# EAGLE schematic MainBoard (EAGLE 9.1.2)
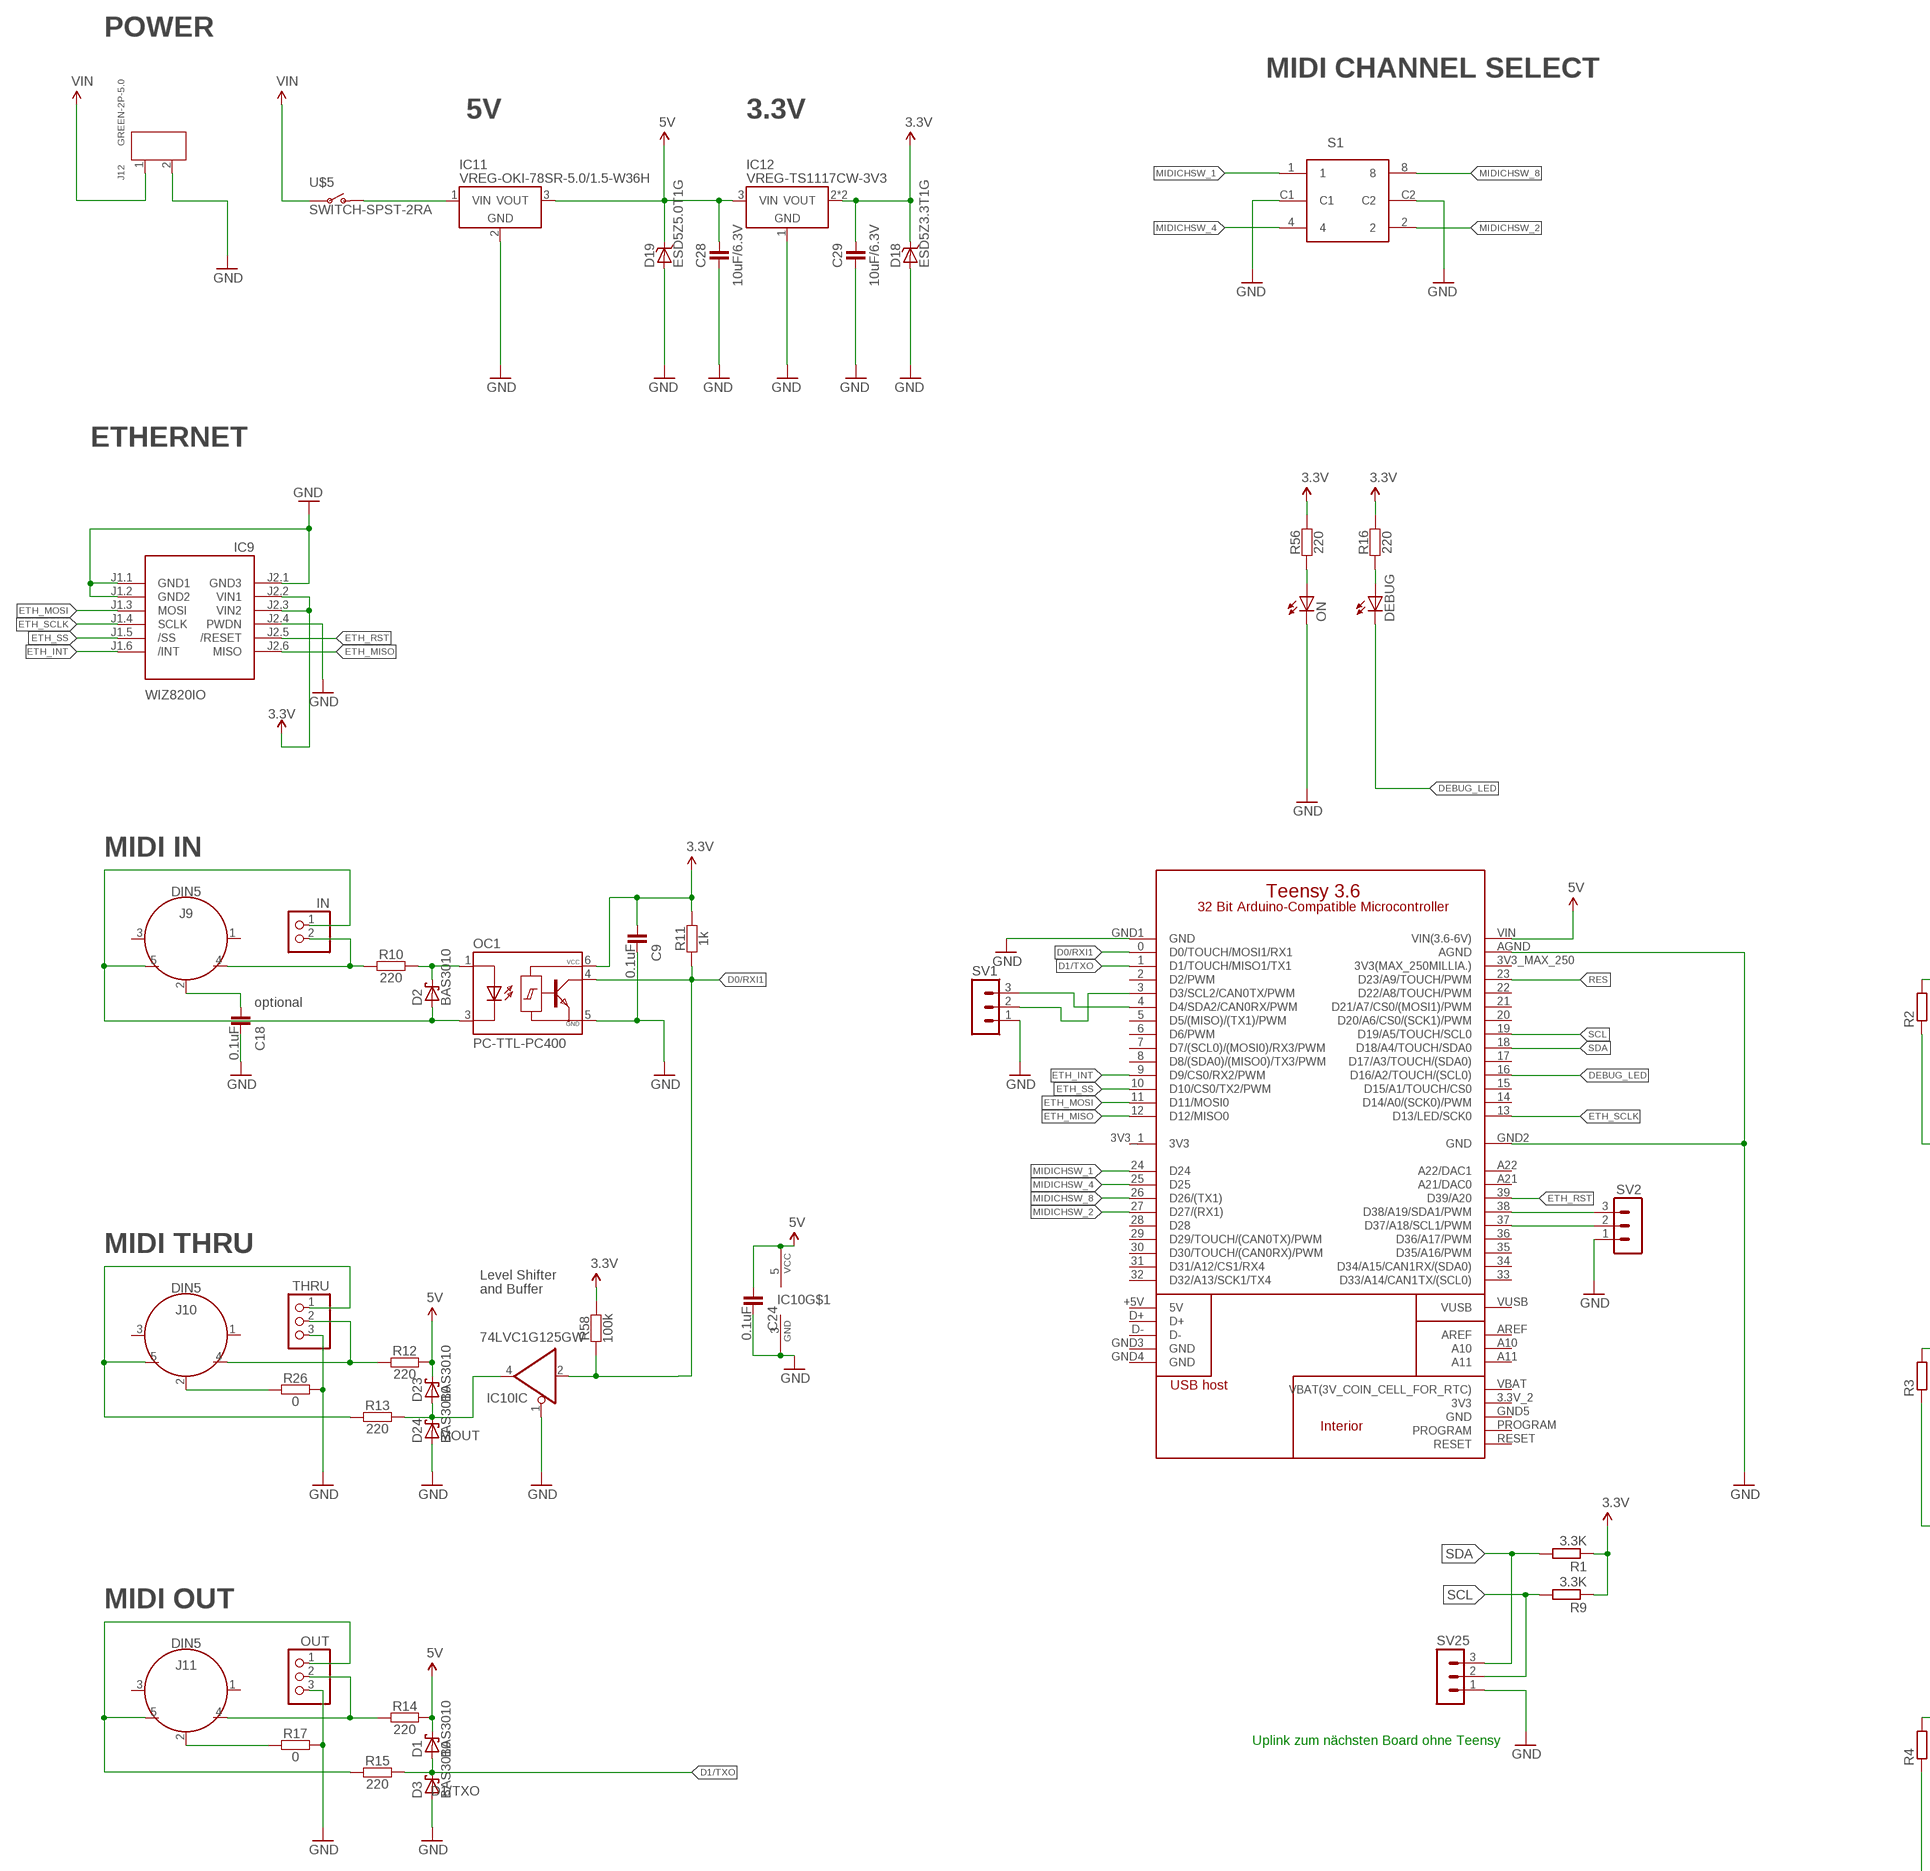
[diagram p0: schematic, sheet 1, part 1 of 2]
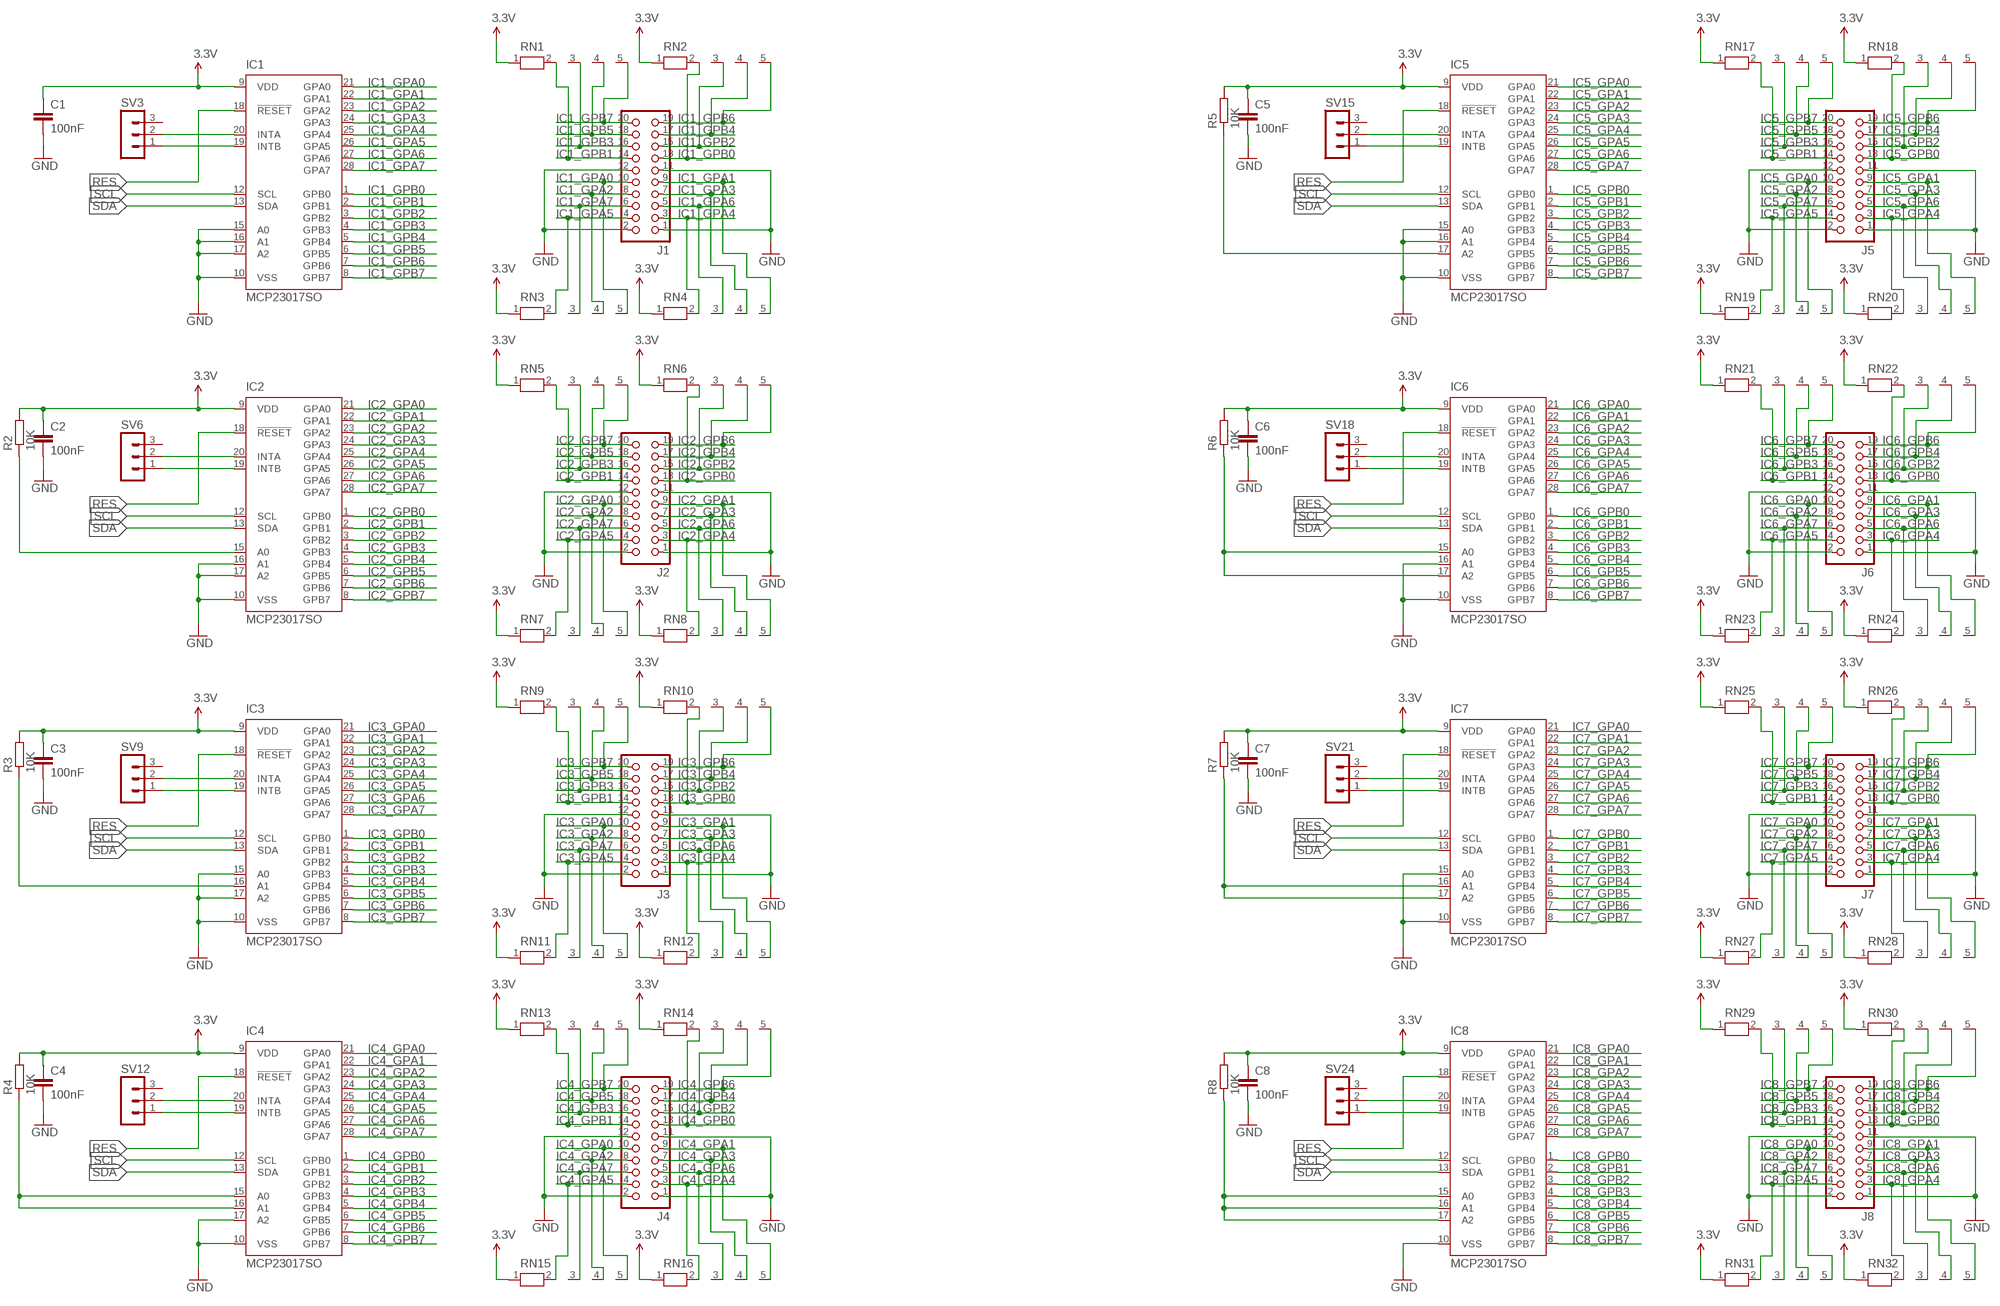
[diagram p1: schematic, sheet 1, part 2 of 2]

## Parts
C1  100nF  C-EUC0805  [C0805]
C2  100nF  C-EUC0805  [C0805]
C3  100nF  C-EUC0805  [C0805]
C4  100nF  C-EUC0805  [C0805]
C5  100nF  C-EUC0805  [C0805]
C6  100nF  C-EUC0805  [C0805]
C7  100nF  C-EUC0805  [C0805]
C8  100nF  C-EUC0805  [C0805]
C9  0.1uF  CAPACITOR-0805  [C0805]
C18  0.1uF  CAPACITOR-0805  [C0805]
C24  0.1uF  CAPACITOR-0805  [C0805]
C28  10uF/6.3V  CAPACITOR-0805  [C0805]
C29  10uF/6.3V  CAPACITOR-0805  [C0805]
D1  BAS3010  D_SCHOTTKY-SOD323  [SOD323]
D2  BAS3010  D_SCHOTTKY-SOD323  [SOD323]
D3  BAS3010  D_SCHOTTKY-SOD323  [SOD323]
D18  ESD5Z3.3T1G  D_TVS-SOD523  [SOD523]
D19  ESD5Z5.0T1G  D_TVS-SOD523  [SOD523]
D23  BAS3010  D_SCHOTTKY-SOD323  [SOD323]
D24  BAS3010  D_SCHOTTKY-SOD323  [SOD323]
DEBUG  Red  LED-3MM  [LED_3MM]
IC1  MCP23017SO  [SO28W]
IC2  MCP23017SO  [SO28W]
IC3  MCP23017SO  [SO28W]
IC4  MCP23017SO  [SO28W]
IC5  MCP23017SO  [SO28W]
IC6  MCP23017SO  [SO28W]
IC7  MCP23017SO  [SO28W]
IC8  MCP23017SO  [SO28W]
IC9  WIZ820IO_DEVICE'DUAL-IN-LINE'  [WIZ820IO]
IC10  74LVC1G125GW  74HCT1G125GW  [SOT353]
IC11  VREG-OKI-78SR-5.0/1.5-W36H  [OKI-78SR-H]
IC12  VREG-TS1117CW-3V3  [SOT223]
IN  PINHD-1X2  [1X02]
J1  CON_HEADER_2X10-SHROUDED  [PINSHRD_PTH_2X10]
J2  CON_HEADER_2X10-SHROUDED  [PINSHRD_PTH_2X10]
J3  CON_HEADER_2X10-SHROUDED  [PINSHRD_PTH_2X10]
J4  CON_HEADER_2X10-SHROUDED  [PINSHRD_PTH_2X10]
J5  CON_HEADER_2X10-SHROUDED  [PINSHRD_PTH_2X10]
J6  CON_HEADER_2X10-SHROUDED  [PINSHRD_PTH_2X10]
J7  CON_HEADER_2X10-SHROUDED  [PINSHRD_PTH_2X10]
J8  CON_HEADER_2X10-SHROUDED  [PINSHRD_PTH_2X10]
J9  DIN5  [DIN5-RA-PTH]
J10  DIN5  [DIN5-RA-PTH]
J11  DIN5  [DIN5-RA-PTH]
J12  GREEN-2P-5.0  SCREW-TERMINAL-GREEN(2P-5.0)  [H2-5.0-10.5X8.0MM]
OC1  PC-TTL-PC400  [MINIFLAT5]
ON  Red  LED-3MM  [LED_3MM]
OUT  PINHD-1X3  [1X03]
R1  3.3K  R-EU_R0805  [R0805]
R2  10K  R-EU_R0805  [R0805]
R3  10K  R-EU_R0805  [R0805]
R4  10K  R-EU_R0805  [R0805]
R5  10K  R-EU_R0805  [R0805]
R6  10K  R-EU_R0805  [R0805]
R7  10K  R-EU_R0805  [R0805]
R8  10K  R-EU_R0805  [R0805]
R9  3.3K  R-EU_R0805  [R0805]
R10  220  RESISTOR-0805  [C0805]
R11  1k  RESISTOR-0805  [C0805]
R12  220  RESISTOR-0805  [C0805]
R13  220  RESISTOR-0805  [C0805]
R14  220  RESISTOR-0805  [C0805]
R15  220  RESISTOR-0805  [C0805]
R16  220  RESISTOR-0805  [C0805]
R17  0  RESISTOR-0805  [C0805]
R26  0  RESISTOR-0805  [C0805]
R56  220  RESISTOR-0805  [C0805]
R58  100k  RESISTOR-0805  [C0805]
RN1  RN04  [RN-5]
RN2  RN04  [RN-5]
RN3  RN04  [RN-5]
RN4  RN04  [RN-5]
RN5  RN04  [RN-5]
RN6  RN04  [RN-5]
RN7  RN04  [RN-5]
RN8  RN04  [RN-5]
RN9  RN04  [RN-5]
RN10  RN04  [RN-5]
RN11  RN04  [RN-5]
RN12  RN04  [RN-5]
RN13  RN04  [RN-5]
RN14  RN04  [RN-5]
RN15  RN04  [RN-5]
RN16  RN04  [RN-5]
RN17  RN04  [RN-5]
RN18  RN04  [RN-5]
RN19  RN04  [RN-5]
RN20  RN04  [RN-5]
RN21  RN04  [RN-5]
RN22  RN04  [RN-5]
RN23  RN04  [RN-5]
RN24  RN04  [RN-5]
RN25  RN04  [RN-5]
RN26  RN04  [RN-5]
RN27  RN04  [RN-5]
RN28  RN04  [RN-5]
RN29  RN04  [RN-5]
RN30  RN04  [RN-5]
RN31  RN04  [RN-5]
RN32  RN04  [RN-5]
S1  428521420916  [428521420916]
SV1  MA03-1  [MA03-1]
SV2  MA03-1  [MA03-1]
SV3  MA03-1  [MA03-1]
SV6  MA03-1  [MA03-1]
SV9  MA03-1  [MA03-1]
SV12  MA03-1  [MA03-1]
SV15  MA03-1  [MA03-1]
SV18  MA03-1  [MA03-1]
SV21  MA03-1  [MA03-1]
SV24  MA03-1  [MA03-1]
SV25  MA03-1  [MA03-1]
THRU  PINHD-1X3  [1X03]
U$1  TEENSY-3.6_ONLY_HOLES  [TEENSY-3.6_ONLY_HOLES]
U$5  SWITCH-SPST-2RA  [R_SW_TH]

## Nets
3.3V: C1.1 C2.1 C3.1 C4.1 C5.1 C6.1 C7.1 C8.1 C9.2 C29.2 D18.C IC1.9(VDD) IC2.9(VDD) IC3.9(VDD) IC4.9(VDD) IC5.9(VDD) IC6.9(VDD) IC7.9(VDD) IC8.9(VDD) IC9.J2.2(VIN1) IC9.J2.3(VIN2) IC12.2(VOUT) IC12.4(VOUT) OC1.6(VCC) R1.1 R2.2 R3.2 R4.2 R5.2 R6.2 R7.2 R8.2 R9.1 R11.2 R16.2 R56.2 R58.2 RN1.1 RN2.1 RN3.1 RN4.1 RN5.1 RN6.1 RN7.1 RN8.1 RN9.1 RN10.1 RN11.1 RN12.1 RN13.1 RN14.1 RN15.1 RN16.1 RN17.1 RN18.1 RN19.1 RN20.1 RN21.1 RN22.1 RN23.1 RN24.1 RN25.1 RN26.1 RN27.1 RN28.1 RN29.1 RN30.1 RN31.1 RN32.1
5V: C24.2 C28.2 D1.C D19.C D23.C IC10.5(VCC) IC11.3(VOUT) IC12.3(VIN) R12.2 R14.2 U$1.VIN(VIN(3.6-6V))
D0/RXI1: IC10.2(IC:I) OC1.4(OUT) R11.1 R58.1 U$1.0(D0/TOUCH/MOSI1/RX1)
D1/TXO: D1.A D3.C R15.2 U$1.1(D1/TOUCH/MISO1/TX1)
DEBUG_LED: DEBUG.C U$1.16(D16/A2/TOUCH/(SCL0))
ETH_INT: IC9.J1.6(/INT) U$1.9(D9/CS0/RX2/PWM)
ETH_MISO: IC9.J2.6(MISO) U$1.12(D12/MISO0)
ETH_MOSI: IC9.J1.3(MOSI) U$1.11(D11/MOSI0)
ETH_RST: IC9.J2.5(/RESET) U$1.39(D39/A20)
ETH_SCLK: IC9.J1.4(SCLK) U$1.13(D13/LED/SCK0)
ETH_SS: IC9.J1.5(/SS) U$1.10(D10/CS0/TX2/PWM)
GND: C1.2 C2.2 C3.2 C4.2 C5.2 C6.2 C7.2 C8.2 C9.1 C18.1 C24.1 C28.1 C29.1 D3.A D18.A D19.A D24.A IC1.10(VSS) IC1.15(A0) IC1.16(A1) IC1.17(A2) IC2.10(VSS) IC2.16(A1) IC2.17(A2) IC3.10(VSS) IC3.15(A0) IC3.17(A2) IC4.10(VSS) IC4.17(A2) IC5.10(VSS) IC5.15(A0) IC5.16(A1) IC6.10(VSS) IC6.16(A1) IC7.10(VSS) IC7.15(A0) IC8.10(VSS) IC9.J1.1(GND1) IC9.J1.2(GND2) IC9.J2.1(GND3) IC9.J2.4(PWDN) IC10.1(IC:OE) IC10.3(GND) IC11.2(GND) IC12.1(GND) J1.1 J1.2 J1.11 J1.12 J2.1 J2.2 J2.11 J2.12 J3.1 J3.2 J3.11 J3.12 J4.1 J4.2 J4.11 J4.12 J5.1 J5.2 J5.11 J5.12 J6.1 J6.2 J6.11 J6.12 J7.1 J7.2 J7.11 J7.12 J8.1 J8.2 J8.11 J8.12 J12.2 OC1.5(GND) ON.C OUT.3 R17.2 R26.2 S1.C1 S1.C2 SV1.1 SV2.1 SV25.1 THRU.3 U$1.AGND U$1.GND1(GND) U$1.GND2(GND)
IC1_GPA0: IC1.21(GPA0) J1.10 RN3.5
IC1_GPA1: IC1.22(GPA1) J1.9 RN4.5
IC1_GPA2: IC1.23(GPA2) J1.8 RN3.4
IC1_GPA3: IC1.24(GPA3) J1.7 RN4.4
IC1_GPA4: IC1.25(GPA4) J1.3 RN4.2
IC1_GPA5: IC1.26(GPA5) J1.4 RN3.2
IC1_GPA6: IC1.27(GPA6) J1.5 RN4.3
IC1_GPA7: IC1.28(GPA7) J1.6 RN3.3
IC1_GPB0: IC1.1(GPB0) J1.13 RN2.2
IC1_GPB1: IC1.2(GPB1) J1.14 RN1.2
IC1_GPB2: IC1.3(GPB2) J1.15 RN2.3
IC1_GPB3: IC1.4(GPB3) J1.16 RN1.3
IC1_GPB4: IC1.5(GPB4) J1.17 RN2.4
IC1_GPB5: IC1.6(GPB5) J1.18 RN1.4
IC1_GPB6: IC1.7(GPB6) J1.19 RN2.5
IC1_GPB7: IC1.8(GPB7) J1.20 RN1.5
IC2_GPA0: IC2.21(GPA0) J2.10 RN7.5
IC2_GPA1: IC2.22(GPA1) J2.9 RN8.5
IC2_GPA2: IC2.23(GPA2) J2.8 RN7.4
IC2_GPA3: IC2.24(GPA3) J2.7 RN8.4
IC2_GPA4: IC2.25(GPA4) J2.3 RN8.2
IC2_GPA5: IC2.26(GPA5) J2.4 RN7.2
IC2_GPA6: IC2.27(GPA6) J2.5 RN8.3
IC2_GPA7: IC2.28(GPA7) J2.6 RN7.3
IC2_GPB0: IC2.1(GPB0) J2.13 RN6.2
IC2_GPB1: IC2.2(GPB1) J2.14 RN5.2
IC2_GPB2: IC2.3(GPB2) J2.15 RN6.3
IC2_GPB3: IC2.4(GPB3) J2.16 RN5.3
IC2_GPB4: IC2.5(GPB4) J2.17 RN6.4
IC2_GPB5: IC2.6(GPB5) J2.18 RN5.4
IC2_GPB6: IC2.7(GPB6) J2.19 RN6.5
IC2_GPB7: IC2.8(GPB7) J2.20 RN5.5
IC3_GPA0: IC3.21(GPA0) J3.10 RN11.5
IC3_GPA1: IC3.22(GPA1) J3.9 RN12.5
IC3_GPA2: IC3.23(GPA2) J3.8 RN11.4
IC3_GPA3: IC3.24(GPA3) J3.7 RN12.4
IC3_GPA4: IC3.25(GPA4) J3.3 RN12.2
IC3_GPA5: IC3.26(GPA5) J3.4 RN11.2
IC3_GPA6: IC3.27(GPA6) J3.5 RN12.3
IC3_GPA7: IC3.28(GPA7) J3.6 RN11.3
IC3_GPB0: IC3.1(GPB0) J3.13 RN10.2
IC3_GPB1: IC3.2(GPB1) J3.14 RN9.2
IC3_GPB2: IC3.3(GPB2) J3.15 RN10.3
IC3_GPB3: IC3.4(GPB3) J3.16 RN9.3
IC3_GPB4: IC3.5(GPB4) J3.17 RN10.4
IC3_GPB5: IC3.6(GPB5) J3.18 RN9.4
IC3_GPB6: IC3.7(GPB6) J3.19 RN10.5
IC3_GPB7: IC3.8(GPB7) J3.20 RN9.5
IC4_GPA0: IC4.21(GPA0) J4.10 RN15.5
IC4_GPA1: IC4.22(GPA1) J4.9 RN16.5
IC4_GPA2: IC4.23(GPA2) J4.8 RN15.4
IC4_GPA3: IC4.24(GPA3) J4.7 RN16.4
IC4_GPA4: IC4.25(GPA4) J4.3 RN16.2
IC4_GPA5: IC4.26(GPA5) J4.4 RN15.2
IC4_GPA6: IC4.27(GPA6) J4.5 RN16.3
IC4_GPA7: IC4.28(GPA7) J4.6 RN15.3
IC4_GPB0: IC4.1(GPB0) J4.13 RN14.2
IC4_GPB1: IC4.2(GPB1) J4.14 RN13.2
IC4_GPB2: IC4.3(GPB2) J4.15 RN14.3
IC4_GPB3: IC4.4(GPB3) J4.16 RN13.3
IC4_GPB4: IC4.5(GPB4) J4.17 RN14.4
IC4_GPB5: IC4.6(GPB5) J4.18 RN13.4
IC4_GPB6: IC4.7(GPB6) J4.19 RN14.5
IC4_GPB7: IC4.8(GPB7) J4.20 RN13.5
IC5_GPA0: IC5.21(GPA0) J5.10 RN19.5
IC5_GPA1: IC5.22(GPA1) J5.9 RN20.5
IC5_GPA2: IC5.23(GPA2) J5.8 RN19.4
IC5_GPA3: IC5.24(GPA3) J5.7 RN20.4
IC5_GPA4: IC5.25(GPA4) J5.3 RN20.2
IC5_GPA5: IC5.26(GPA5) J5.4 RN19.2
IC5_GPA6: IC5.27(GPA6) J5.5 RN20.3
IC5_GPA7: IC5.28(GPA7) J5.6 RN19.3
IC5_GPB0: IC5.1(GPB0) J5.13 RN18.2
IC5_GPB1: IC5.2(GPB1) J5.14 RN17.2
IC5_GPB2: IC5.3(GPB2) J5.15 RN18.3
IC5_GPB3: IC5.4(GPB3) J5.16 RN17.3
IC5_GPB4: IC5.5(GPB4) J5.17 RN18.4
IC5_GPB5: IC5.6(GPB5) J5.18 RN17.4
IC5_GPB6: IC5.7(GPB6) J5.19 RN18.5
IC5_GPB7: IC5.8(GPB7) J5.20 RN17.5
IC6_GPA0: IC6.21(GPA0) J6.10 RN23.5
IC6_GPA1: IC6.22(GPA1) J6.9 RN24.5
IC6_GPA2: IC6.23(GPA2) J6.8 RN23.4
IC6_GPA3: IC6.24(GPA3) J6.7 RN24.4
IC6_GPA4: IC6.25(GPA4) J6.3 RN24.2
IC6_GPA5: IC6.26(GPA5) J6.4 RN23.2
IC6_GPA6: IC6.27(GPA6) J6.5 RN24.3
IC6_GPA7: IC6.28(GPA7) J6.6 RN23.3
IC6_GPB0: IC6.1(GPB0) J6.13 RN22.2
IC6_GPB1: IC6.2(GPB1) J6.14 RN21.2
IC6_GPB2: IC6.3(GPB2) J6.15 RN22.3
IC6_GPB3: IC6.4(GPB3) J6.16 RN21.3
IC6_GPB4: IC6.5(GPB4) J6.17 RN22.4
IC6_GPB5: IC6.6(GPB5) J6.18 RN21.4
IC6_GPB6: IC6.7(GPB6) J6.19 RN22.5
IC6_GPB7: IC6.8(GPB7) J6.20 RN21.5
IC7_GPA0: IC7.21(GPA0) J7.10 RN27.5
IC7_GPA1: IC7.22(GPA1) J7.9 RN28.5
IC7_GPA2: IC7.23(GPA2) J7.8 RN27.4
IC7_GPA3: IC7.24(GPA3) J7.7 RN28.4
IC7_GPA4: IC7.25(GPA4) J7.3 RN28.2
IC7_GPA5: IC7.26(GPA5) J7.4 RN27.2
IC7_GPA6: IC7.27(GPA6) J7.5 RN28.3
IC7_GPA7: IC7.28(GPA7) J7.6 RN27.3
IC7_GPB0: IC7.1(GPB0) J7.13 RN26.2
IC7_GPB1: IC7.2(GPB1) J7.14 RN25.2
IC7_GPB2: IC7.3(GPB2) J7.15 RN26.3
IC7_GPB3: IC7.4(GPB3) J7.16 RN25.3
IC7_GPB4: IC7.5(GPB4) J7.17 RN26.4
IC7_GPB5: IC7.6(GPB5) J7.18 RN25.4
IC7_GPB6: IC7.7(GPB6) J7.19 RN26.5
IC7_GPB7: IC7.8(GPB7) J7.20 RN25.5
IC8_GPA0: IC8.21(GPA0) J8.10 RN31.5
IC8_GPA1: IC8.22(GPA1) J8.9 RN32.5
IC8_GPA2: IC8.23(GPA2) J8.8 RN31.4
IC8_GPA3: IC8.24(GPA3) J8.7 RN32.4
IC8_GPA4: IC8.25(GPA4) J8.3 RN32.2
IC8_GPA5: IC8.26(GPA5) J8.4 RN31.2
IC8_GPA6: IC8.27(GPA6) J8.5 RN32.3
IC8_GPA7: IC8.28(GPA7) J8.6 RN31.3
IC8_GPB0: IC8.1(GPB0) J8.13 RN30.2
IC8_GPB1: IC8.2(GPB1) J8.14 RN29.2
IC8_GPB2: IC8.3(GPB2) J8.15 RN30.3
IC8_GPB3: IC8.4(GPB3) J8.16 RN29.3
IC8_GPB4: IC8.5(GPB4) J8.17 RN30.4
IC8_GPB5: IC8.6(GPB5) J8.18 RN29.4
IC8_GPB6: IC8.7(GPB6) J8.19 RN30.5
IC8_GPB7: IC8.8(GPB7) J8.20 RN29.5
MIDICHSW_1: S1.1 U$1.24(D24)
MIDICHSW_2: S1.2 U$1.27(D27/(RX1))
MIDICHSW_4: S1.4 U$1.25(D25)
MIDICHSW_8: S1.8 U$1.26(D26/(TX1))
MIDIN: IN.2 J9.4 R10.1
MIDIP: D2.A IN.1 J9.5 OC1.3(C)
MIOT_M: J10.4 R12.1 THRU.2
MIOT_M1: J11.4 OUT.2 R14.1
MIOT_P: J10.5 R13.1 THRU.1
MIOT_P1: J11.5 OUT.1 R15.1
MOUT: D23.A D24.C IC10.4(IC:O) R13.2
N$1: J10.2 R26.1
N$2: D2.C OC1.1(A) R10.2
N$3: J11.2 R17.1
N$4: IC11.1(VIN) U$5.P$3(O)
N$5: SV1.3 U$1.4(D4/SDA2/CAN0RX/PWM)
N$6: SV1.2 U$1.3(D3/SCL2/CAN0TX/PWM)
N$7: DEBUG.A R16.1
N$9: C18.2 J9.2
N$17: IC1.19(INTB) SV3.1
N$18: IC1.20(INTA) SV3.2
N$35: IC2.19(INTB) SV6.1
N$36: IC2.20(INTA) SV6.2
N$37: IC2.15(A0) R2.1
N$54: IC3.19(INTB) SV9.1
N$55: IC3.20(INTA) SV9.2
N$71: ON.A R56.1
N$75: IC4.19(INTB) SV12.1
N$76: IC4.20(INTA) SV12.2
N$77: IC4.15(A0) IC4.16(A1) R4.1
N$78: IC3.16(A1) R3.1
N$92: IC5.19(INTB) SV15.1
N$93: IC5.20(INTA) SV15.2
N$110: IC6.19(INTB) SV18.1
N$111: IC6.20(INTA) SV18.2
N$112: IC6.15(A0) IC6.17(A2) R6.1
N$129: IC7.19(INTB) SV21.1
N$130: IC7.20(INTA) SV21.2
N$147: IC8.19(INTB) SV24.1
N$148: IC8.20(INTA) SV24.2
N$149: IC8.15(A0) IC8.16(A1) IC8.17(A2) R8.1
N$150: IC7.16(A1) IC7.17(A2) R7.1
N$153: IC5.17(A2) R5.1
N$155: SV2.3 U$1.38(D38/A19/SDA1/PWM)
N$156: SV2.2 U$1.37(D37/A18/SCL1/PWM)
RES: IC1.18(!RESET) IC2.18(!RESET) IC3.18(!RESET) IC4.18(!RESET) IC5.18(!RESET) IC6.18(!RESET) IC7.18(!RESET) IC8.18(!RESET) U$1.23(D23/A9/TOUCH/PWM)
SCL: IC1.12(SCL) IC2.12(SCL) IC3.12(SCL) IC4.12(SCL) IC5.12(SCL) IC6.12(SCL) IC7.12(SCL) IC8.12(SCL) R9.2 SV25.2 U$1.19(D19/A5/TOUCH/SCL0)
SDA: IC1.13(SDA) IC2.13(SDA) IC3.13(SDA) IC4.13(SDA) IC5.13(SDA) IC6.13(SDA) IC7.13(SDA) IC8.13(SDA) R1.2 SV25.3 U$1.18(D18/A4/TOUCH/SDA0)
VIN: J12.1 U$5.P$4(P)
Unconnected: J9.1 J9.3 J10.1 J10.3 J11.1 J11.3 SV3.3 SV6.3 SV9.3 SV12.3 SV15.3 SV18.3 SV21.3 SV24.3 U$1.2(D2/PWM) U$1.3.3V_2(3V3) U$1.3V3_MAX_250(3V3(MAX_250MILLIA.)) U$1.5(D5/(MISO)/(TX1)/PWM) U$1.6(D6/PWM) U$1.7(D7/(SCL0)/(MOSI0)/RX3/PWM) U$1.8(D8/(SDA0)/(MISO0)/TX3/PWM) U$1.14(D14/A0/(SCK0)/PWM) U$1.15(D15/A1/TOUCH/CS0) U$1.17(D17/A3/TOUCH/(SDA0)) U$1.20(D20/A6/CS0/(SCK1)/PWM) U$1.21(D21/A7/CS0/(MOSI1)/PWM) U$1.22(D22/A8/TOUCH/PWM) U$1.28(D28) U$1.29(D29/TOUCH/(CAN0TX)/PWM) U$1.30(D30/TOUCH/(CAN0RX)/PWM) U$1.31(D31/A12/CS1/RX4) U$1.32(D32/A13/SCK1/TX4) U$1.33(D33/A14/CAN1TX/(SCL0)) U$1.34(D34/A15/CAN1RX/(SDA0)) U$1.35(D35/A16/PWM) U$1.36(D36/A17/PWM) U$1.+5V(5V) U$1.A10 U$1.A11 U$1.A21(A21/DAC0) U$1.A22(A22/DAC1) U$1.AREF U$1.D+ U$1.D- U$1.GND3(GND) U$1.GND4(GND) U$1.GND5(GND) U$1.PROGRAM U$1.RESET U$1.VBAT(VBAT(3V_COIN_CELL_FOR_RTC)) U$1.VUSB

## Notes on the sheet
- POWER
- MIDI CHANNEL SELECT
- 5V | 3.3V
- ETHERNET
- WIZ820IO
- MIDI IN
- optional
- MIDI THRU
- Level Shifter
  and Buffer
- MIDI OUT
- Uplink zum nächsten Board ohne Teensy

## Power pins joined to a net without a drawn wire
3V3: U$1.3V3_1(3V3)

## Library data of the parts
C1-C8 = rcl:C-EU: CAPACITOR, European symbol; SPICEPREFIX: C
C9 C18 C24 = we-rcl:CAPACITOR: Capacitors ...2.2uF @ 6.3V -> 0402 ...4.7uF @ 6.3V -> 0603 ...10uF @ 16V -> 0805 ...22uF @ 25V -> 1206; MPN: CC0603KRX7R7BB104
C28 C29 = we-rcl:CAPACITOR: Capacitors ...2.2uF @ 6.3V -> 0402 ...4.7uF @ 6.3V -> 0603 ...10uF @ 16V -> 0805 ...22uF @ 25V -> 1206
D1-D3 D23 D24 = we-rcl:D_SCHOTTKY: Schottky Diodes 1A, 30V - SOD323 (BAS3010 or CUS10S40) 2A, 30V - SMA/DO214AC 10A,45V - Z5-T (CDBZ5T1045)
D18 D19 = we-rcl:D_TVS: TVS Diodes (Transient Voltage Suppressor Diodes)
DEBUG ON = we-opto:LED: LEDs red, green, blue -> 0603
IC1-IC8 = microchip:MCP23017: http://ww1.microchip.com/downloads/en/DeviceDoc/21952a.pdf Source: http://ww1.microchip.com/downloads/en/DeviceDoc/21952a.pdf; MF: MICROCHIP; MPN: MCP23017-E/SO; OC_FARNELL: 1332087; OC_NEWARK: 31K2958
IC9 = Wiz820io:WIZ820IO_DEVICE: WIZnet, WIZ820io plug in module incl. W5200 chip and MagJack
IC10 = dadamachines:74HCT1G125GW: Buffers & Line Drivers BUS BFR/LINE DRV;3-S; MPN: 74HCT1G125GW,125
IC11 IC12 = we-power:VREG: Voltage Regulators (LDOs, Switching Converters...) LDOs Taiwan Semi TS1117 800mA max 15V - compatible On Semi NCP1117 1A max 20V - compatible Diodes AP2111H 0.6A max 6V (0.25V@0.6A) - compatible Diodes AP2114H 1A max 6V (0.45V@1A) Taiwan Semi TS9011 250mA max 12V - compatible Diodes AP2210 300mA max 15V - compatible Microchip MCP1700 250mA max 6.5V - compatible Microchip MCP1702 250mA max 13V - compatible Microchip MCP1703 250mA max 16V - compatible Microchip MCP1754 150mA max 16V Taiwan Semi TS5204 150mA max 16V (low noise) DC/DC Converter Modules Recom R-78Ex.x-1.0-W36 1A max 28V - compatible CUI V78xx-2000 2A max 18V Murata OKI-78SR-x.x/1.5-W36 1.5A max 36V
IN = meeblip:PINHD-1X2: PIN HEADER; OC_FARNELL: unknown
J1-J8 = dp_devices:CON_HEADER_2X10
J9-J11 = SparkFun-Connectors:DIN5: DIN5 Connector - Female Right Angle (frequently used as a MIDI Jack connector) This type of connector and cable is frequently used for transmitting midi data (musical instrument digital interface). It is what you usually see on a keyboard or set of electronic drums. Learn more here <https://en.wikipedia.org/wiki/MIDI>. For more information on the pinout and electrical specifications of MIDI communications, please see the following resource: https://www.midi.org/specifications/item/midi-din-electrical-specification Here is the connector we sell at SparkFun: MIDI Connector - Female Right Angle <https://www.sparkfun.com/products/9536> (PRT-09536) Datasheet <hhttp://www.sparkfun.com/datasheets/Prototyping/Connectors/MIDI-RA.pdf> It is used on this SparkFun product: SparkFun MIDI Shield <https://www.sparkfun.com/products/12898> (DEV-12898); PROD_ID: CONN-09481
J12 = Seeed-Connector:SCREW-TERMINAL-GREEN(2P-5.0): 320110031
OC1 = we-opto:PC-TTL: Photocoupler with TTL Output; DIGIKEY: 425-2140-6-ND; MPN: PC400J00000F
OUT THRU = pinhead:PINHD-1X3: PIN HEADER; OC_FARNELL: unknown
R1-R9 = rcl:R-EU_: RESISTOR, European symbol; SPICEPREFIX: R
R10 R11 R16 R17 R26 R56 R58 = we-rcl:RESISTOR: Resistors all kinds in 0402 and 0603
R12-R15 = we-rcl:RESISTOR: Resistors all kinds in 0402 and 0603; PARTNO: ERJ-3EKF2200V
RN1-RN32 = resistor-net:RN04: RESISTOR NETWORK; OC_FARNELL: unknown; OC_NEWARK: unknown
S1 = Eagle_SWITCHES (rev18a):428521420916: 10x10 mm washable SMD shaft type WS-ROSV,16 position <http://katalog.we-online.de/media/images/v2/Family_WS-ROTV_10x10mm_washable_THT_Rotary_Switch_4285274209xx.jpg> Details see: http://katalog.we-online.de/en/em/ROSV_10X10_WASHABLE_SMD_SHAFT_TYPE 2015 (C) Würth Elektronik
SV1-SV3 SV6 SV9 SV12 SV15 SV18 SV21 SV24 SV25 = con-lstb:MA03-1: PIN HEADER; OC_FARNELL: unknown; OC_NEWARK: unknown
U$1 = Teensy-3.6:TEENSY-3.6_ONLY_HOLES
U$5 = SparkFun-Retired:SWITCH-SPST-2